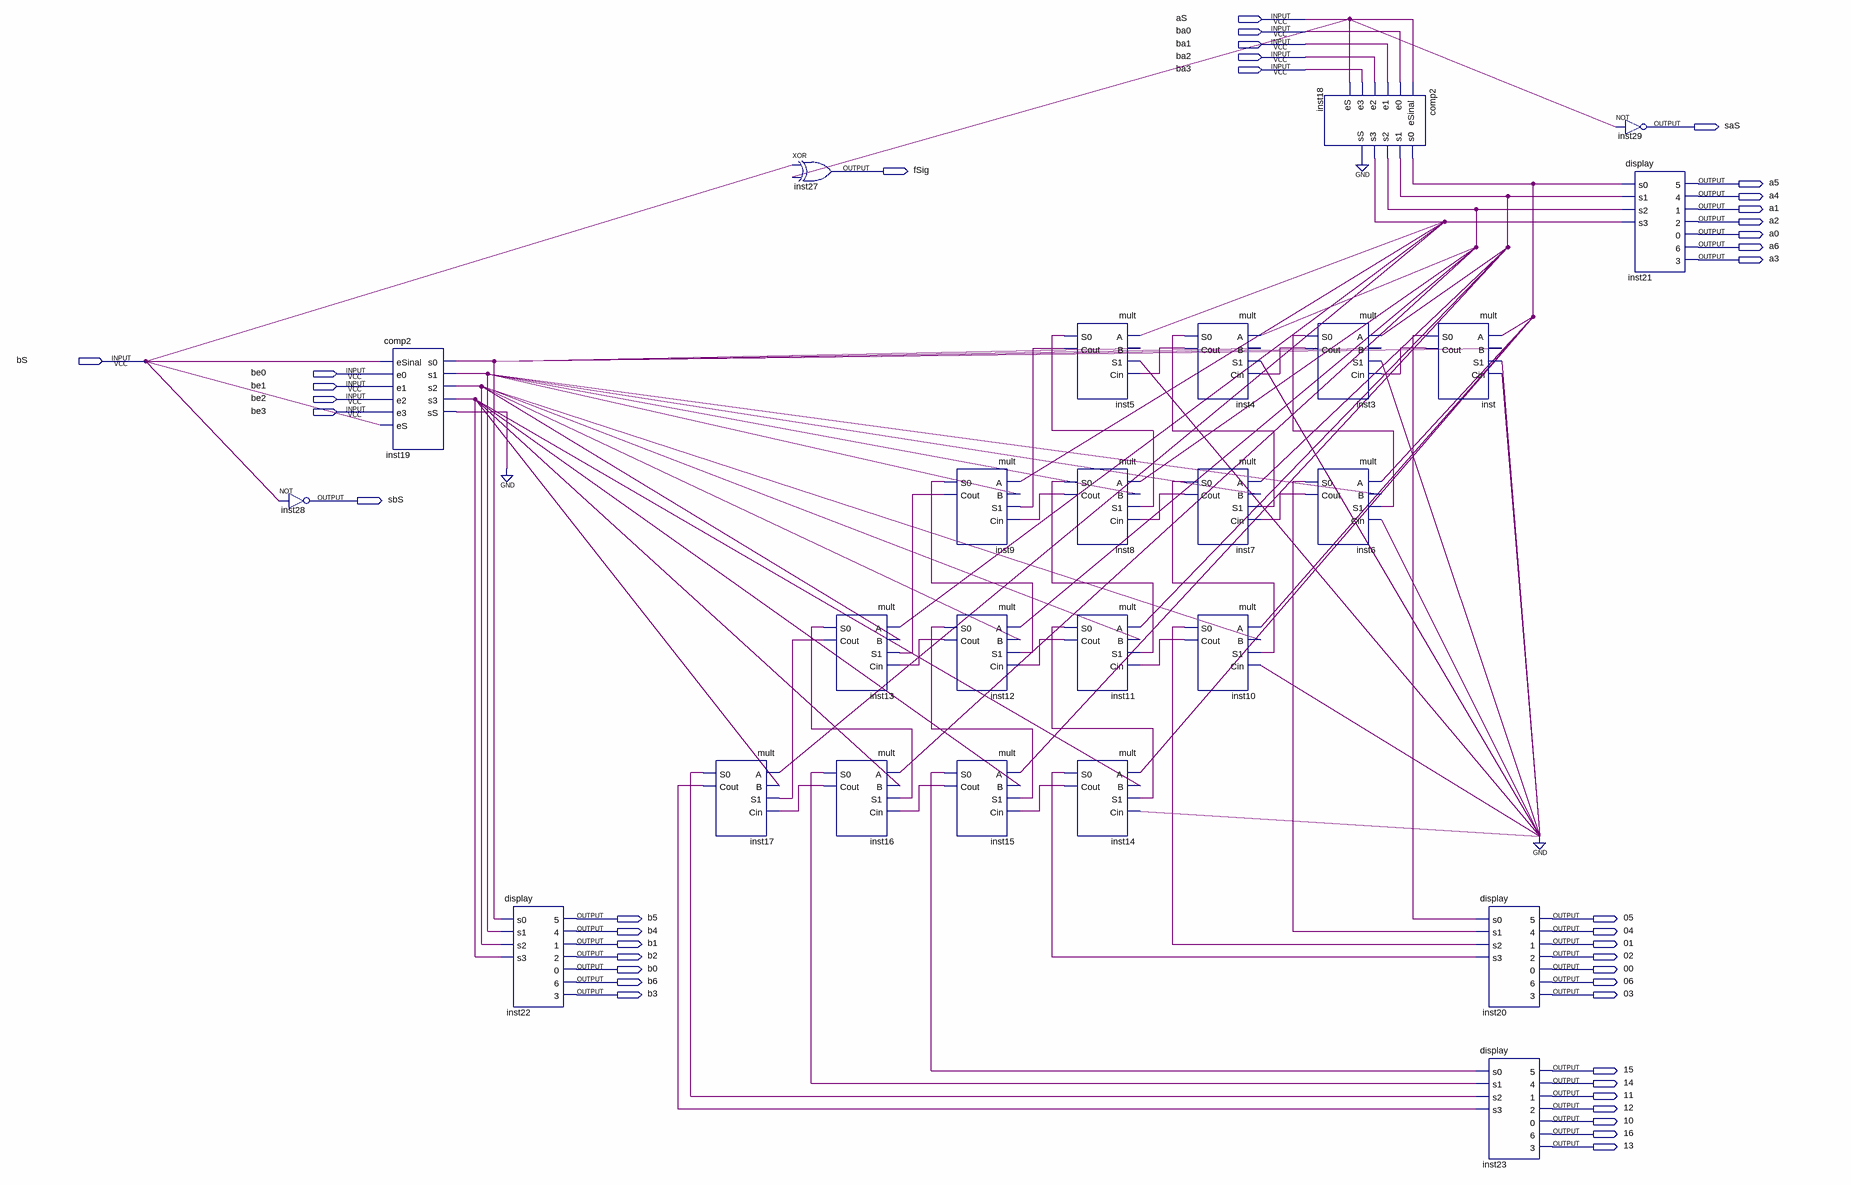
[diagram p0: schematic sheet]
// Quartus schematic multiplicador.bdf as structural Verilog: 25 symbols, 41 pins
module multiplicador (
  input  aS,
  input  ba0,
  input  ba1,
  input  ba2,
  input  ba3,
  input  bS,
  input  be0,
  input  be1,
  input  be2,
  input  be3,
  output saS,
  output fSig,
  output a5,
  output a4,
  output a1,
  output a2,
  output a0,
  output a6,
  output a3,
  output sbS,
  output b5,
  output \05 ,
  output b4,
  output \04 ,
  output b1,
  output \01 ,
  output b2,
  output \02 ,
  output b0,
  output \00 ,
  output b6,
  output \06 ,
  output b3,
  output \03 ,
  output \15 ,
  output \14 ,
  output \11 ,
  output \12 ,
  output \10 ,
  output \16 ,
  output \13 
);

  wire inst3_cout, inst3_s0, inst4_cout, inst4_s0, inst5_cout, inst5_s0, inst6_cout, inst6_s0, inst7_cout,
       inst7_s0, inst8_cout, inst8_s0, inst9_cout, inst9_s0, inst10_cout, inst10_s0, inst11_cout, inst11_s0,
       inst12_cout, inst12_s0, inst13_cout, inst13_s0, inst14_cout, inst14_s0, inst15_cout, inst15_s0,
       inst16_cout, inst16_s0, inst17_cout, inst17_s0, inst18_s0, inst18_s1, inst18_s2, inst18_s3, inst18_ss,
       inst19_s0, inst19_s1, inst19_s2, inst19_s3, inst19_ss, inst_cout, inst_s0;

  not inst28 (sbS, bS);
  comp2 inst19 (
    .eSinal(bS), .e0(be0), .e1(be1), .e2(be2), .e3(be3), .eS(bS), .s0(inst19_s0), .s1(inst19_s1),
    .s2(inst19_s2), .s3(inst19_s3), .sS(inst19_ss));
  display inst22 (
    .s0(inst19_s0), .s1(inst19_s1), .s2(inst19_s2), .s3(inst19_s3), .\5 (b5), .\4 (b4), .\1 (b1), .\2 (b2),
    .\0 (b0), .\6 (b6), .\3 (b3));
  mult inst17 (.A(inst18_s3), .B(inst19_s3), .S1(inst13_cout), .Cin(inst16_cout), .S0(inst17_s0), .Cout(inst17_cout));
  xor inst27 (fSig, bS, aS);
  mult inst13 (.A(inst18_s3), .B(inst19_s2), .S1(inst9_cout), .Cin(inst12_cout), .S0(inst13_s0), .Cout(inst13_cout));
  mult inst16 (.A(inst18_s2), .B(inst19_s3), .S1(inst13_s0), .Cin(inst15_cout), .S0(inst16_s0), .Cout(inst16_cout));
  mult inst9 (.A(inst18_s3), .B(inst19_s1), .S1(inst5_cout), .Cin(inst8_cout), .S0(inst9_s0), .Cout(inst9_cout));
  mult inst12 (.A(inst18_s2), .B(inst19_s2), .S1(inst9_s0), .Cin(inst11_cout), .S0(inst12_s0), .Cout(inst12_cout));
  mult inst15 (.A(inst18_s1), .B(inst19_s3), .S1(inst12_s0), .Cin(inst14_cout), .S0(inst15_s0), .Cout(inst15_cout));
  mult inst5 (.A(inst18_s3), .B(inst19_s0), .S1(1'b0), .Cin(inst4_cout), .S0(inst5_s0), .Cout(inst5_cout));
  mult inst8 (.A(inst18_s2), .B(inst19_s1), .S1(inst5_s0), .Cin(inst7_cout), .S0(inst8_s0), .Cout(inst8_cout));
  mult inst11 (.A(inst18_s1), .B(inst19_s2), .S1(inst8_s0), .Cin(inst10_cout), .S0(inst11_s0), .Cout(inst11_cout));
  mult inst14 (.A(inst18_s0), .B(inst19_s3), .S1(inst11_s0), .Cin(1'b0), .S0(inst14_s0), .Cout(inst14_cout));
  mult inst4 (.A(inst18_s2), .B(inst19_s0), .S1(1'b0), .Cin(inst3_cout), .S0(inst4_s0), .Cout(inst4_cout));
  mult inst7 (.A(inst18_s1), .B(inst19_s1), .S1(inst4_s0), .Cin(inst6_cout), .S0(inst7_s0), .Cout(inst7_cout));
  mult inst10 (.A(inst18_s0), .B(inst19_s2), .S1(inst7_s0), .Cin(1'b0), .S0(inst10_s0), .Cout(inst10_cout));
  comp2 inst18 (
    .eSinal(aS), .e0(ba0), .e1(ba1), .e2(ba2), .e3(ba3), .eS(aS), .s0(inst18_s0), .s1(inst18_s1),
    .s2(inst18_s2), .s3(inst18_s3), .sS(inst18_ss));
  mult inst3 (.A(inst18_s1), .B(inst19_s0), .S1(1'b0), .Cin(inst_cout), .S0(inst3_s0), .Cout(inst3_cout));
  mult inst6 (.A(inst18_s0), .B(inst19_s1), .S1(inst3_s0), .Cin(1'b0), .S0(inst6_s0), .Cout(inst6_cout));
  mult inst (.A(inst18_s0), .B(inst19_s0), .S1(1'b0), .Cin(1'b0), .S0(inst_s0), .Cout(inst_cout));
  display inst20 (
    .s0(inst_s0), .s1(inst6_s0), .s2(inst10_s0), .s3(inst14_s0), .\5 (\05 ), .\4 (\04 ), .\1 (\01 ),
    .\2 (\02 ), .\0 (\00 ), .\6 (\06 ), .\3 (\03 ));
  display inst23 (
    .s0(inst15_s0), .s1(inst16_s0), .s2(inst17_s0), .s3(inst17_cout), .\5 (\15 ), .\4 (\14 ), .\1 (\11 ),
    .\2 (\12 ), .\0 (\10 ), .\6 (\16 ), .\3 (\13 ));
  not inst29 (saS, aS);
  display inst21 (
    .s0(inst18_s0), .s1(inst18_s1), .s2(inst18_s2), .s3(inst18_s3), .\5 (a5), .\4 (a4), .\1 (a1), .\2 (a2),
    .\0 (a0), .\6 (a6), .\3 (a3));
  // also tied to GND on the sheet: {inst19_ss, inst18_ss}
endmodule
